# EAGLE schematic oneslave (EAGLE 7.5.0)
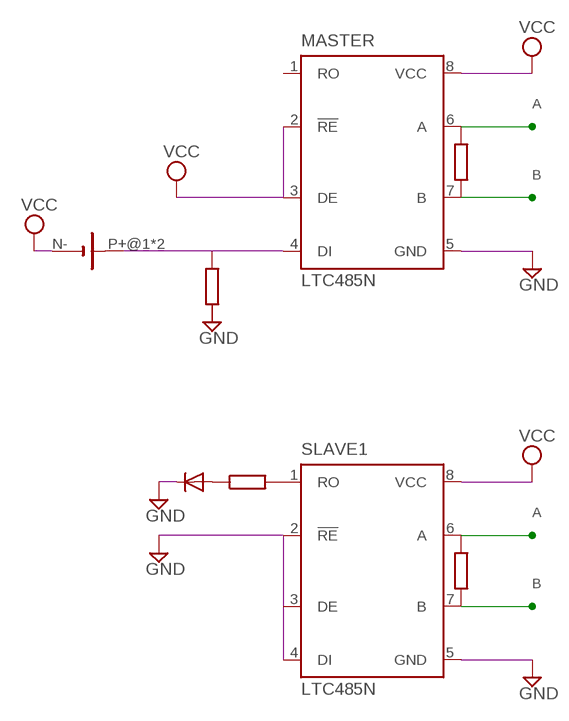
[diagram p0: schematic, sheet 1]

## Parts
D1  1N4004  [DO41-10]
G1  BATTERY-HOLDER_11.6MM  [CELL_RETAINER_11.6MM]
MASTER  LTC485N  [DIL08]
SLAVE1  LTC485N  [DIL08]

## Nets
A: MASTER.6(A) SLAVE1.6(A)
B: MASTER.7(B) SLAVE1.7(B)
Unconnected: D1.A D1.C G1.N-(-) G1.P+@1(+) G1.P+@2(+) MASTER.1(RO) MASTER.2(!RE) MASTER.3(DE) MASTER.4(DI) MASTER.5(GND) MASTER.8(VCC) SLAVE1.1(RO) SLAVE1.2(!RE) SLAVE1.3(DE) SLAVE1.4(DI) SLAVE1.5(GND) SLAVE1.8(VCC)

## Library data of the parts
D1 = diode:1N4004: DIODE general purpose rectifier, 1 A
G1 = battery:BATTERY-HOLDER_11.6MM: 11.6mm PC BUTTON CELL RETAINER, high 5.97mm KEYSTONE ELECTRONICS CORP. Data sheet <http://www.farnell.com/cad/1718310.pdf>; MF: KEYSTONE; MPN: 2997; OC_FARNELL: 2293265
MASTER SLAVE1 = linear-technology:LTC485: Low Power RS485 Interface Transceiver Source: http://www.linear.com/pc/downloadDocument.do?navId=H0,C1,C1007,C1017,P2064,D1718; OC_FARNELL: unknown; OC_NEWARK: unknown